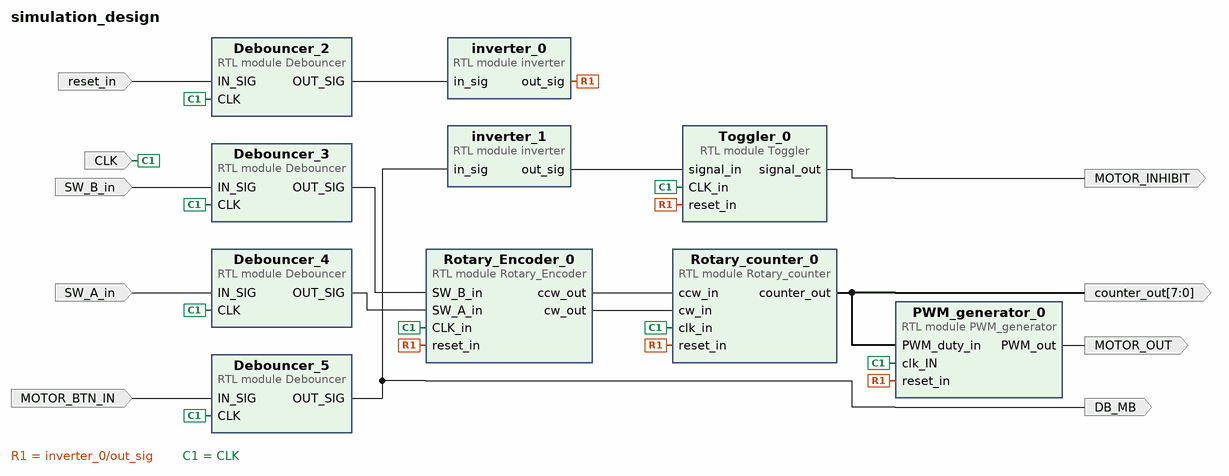
[diagram p0: block diagram of the top level]
# Vivado block design simulation_design, xc7z010clg225-1, Vivado 2016.3
create_bd_design simulation_design

create_bd_port -dir I MOTOR_BTN_IN
create_bd_port -dir O MOTOR_INHIBIT
create_bd_port -dir O MOTOR_OUT
create_bd_port -dir I SW_A_in
create_bd_port -dir I SW_B_in
create_bd_port -dir O -from 7 -to 0 counter_out
create_bd_port -dir I -type rst reset_in
set_property -dict {CONFIG.POLARITY ACTIVE_LOW} [get_bd_ports reset_in]
create_bd_port -dir I CLK
create_bd_port -dir O DB_MB

create_bd_cell -type module -reference Debouncer Debouncer_2
set_property -dict {CONFIG.THRESHOLD 100000} [get_bd_cells Debouncer_2]
create_bd_cell -type module -reference Debouncer Debouncer_3
set_property -dict {CONFIG.THRESHOLD 1000} [get_bd_cells Debouncer_3]
create_bd_cell -type module -reference Debouncer Debouncer_4
set_property -dict {CONFIG.THRESHOLD 100000} [get_bd_cells Debouncer_4]
create_bd_cell -type module -reference Debouncer Debouncer_5
set_property -dict {CONFIG.THRESHOLD 100000} [get_bd_cells Debouncer_5]
create_bd_cell -type module -reference PWM_generator PWM_generator_0
create_bd_cell -type module -reference Rotary_Encoder Rotary_Encoder_0
create_bd_cell -type module -reference Rotary_counter Rotary_counter_0
create_bd_cell -type module -reference Toggler Toggler_0
create_bd_cell -type module -reference inverter inverter_0
create_bd_cell -type module -reference inverter inverter_1

# ---- connections ----

connect_bd_net [get_bd_pins Debouncer_2/OUT_SIG] [get_bd_pins inverter_0/in_sig]
connect_bd_net [get_bd_pins Debouncer_3/OUT_SIG] [get_bd_pins Rotary_Encoder_0/SW_B_in]
connect_bd_net [get_bd_pins Debouncer_4/OUT_SIG] [get_bd_pins Rotary_Encoder_0/SW_A_in]
connect_bd_net [get_bd_pins Debouncer_5/OUT_SIG] [get_bd_pins inverter_1/in_sig] [get_bd_ports DB_MB]
connect_bd_net [get_bd_ports MOTOR_BTN_IN] [get_bd_pins Debouncer_5/IN_SIG]
connect_bd_net [get_bd_pins PWM_generator_0/PWM_out] [get_bd_ports MOTOR_OUT]
connect_bd_net [get_bd_pins Rotary_Encoder_0/ccw_out] [get_bd_pins Rotary_counter_0/ccw_in]
connect_bd_net [get_bd_pins Rotary_Encoder_0/cw_out] [get_bd_pins Rotary_counter_0/cw_in]
connect_bd_net [get_bd_pins Rotary_counter_0/counter_out] [get_bd_ports counter_out] [get_bd_pins PWM_generator_0/PWM_duty_in]
connect_bd_net [get_bd_ports SW_A_in] [get_bd_pins Debouncer_4/IN_SIG]
connect_bd_net [get_bd_ports SW_B_in] [get_bd_pins Debouncer_3/IN_SIG]
connect_bd_net [get_bd_pins Toggler_0/signal_out] [get_bd_ports MOTOR_INHIBIT]
connect_bd_net [get_bd_pins inverter_0/out_sig] \
  [get_bd_pins Toggler_0/reset_in] [get_bd_pins Rotary_counter_0/reset_in] [get_bd_pins PWM_generator_0/reset_in] \
  [get_bd_pins Rotary_Encoder_0/reset_in]
connect_bd_net [get_bd_pins inverter_1/out_sig] [get_bd_pins Toggler_0/signal_in]
connect_bd_net -net processing_system7_0_FCLK_CLK1 [get_bd_ports CLK] \
  [get_bd_pins Debouncer_2/CLK] [get_bd_pins Debouncer_4/CLK] [get_bd_pins Toggler_0/CLK_in] [get_bd_pins Debouncer_3/CLK] \
  [get_bd_pins Debouncer_5/CLK] [get_bd_pins Rotary_counter_0/clk_in] [get_bd_pins PWM_generator_0/clk_IN] \
  [get_bd_pins Rotary_Encoder_0/CLK_in]
connect_bd_net [get_bd_ports reset_in] [get_bd_pins Debouncer_2/IN_SIG]

validate_bd_design
save_bd_design
